# Altium project Common_Sensor_Box.PrjPCB (part 8 of 17)

## Sheet Sensor_Box_Hub_OrangePi.SchDoc: Title
size 420 x 297 mm; Author: G.Kasprowicz; CompanyName: WUT ISE; DrawnBy: G.Kasprowicz; Organization: WUT ISE; Address1: PW ISE; Address2: Nowowiejska 15/19 00-665 Warsaw; Address3: gkasprow@gmail.com; Revision: 1.0; SheetNumber: -; SheetTotal: -; ModifiedBy: -; CheckedDate: -; Title2: Title2; DivGrp: WUT ISE; Designer: G.Kasprowicz; ModifiedDate: -; ProjectName: Sensor Box
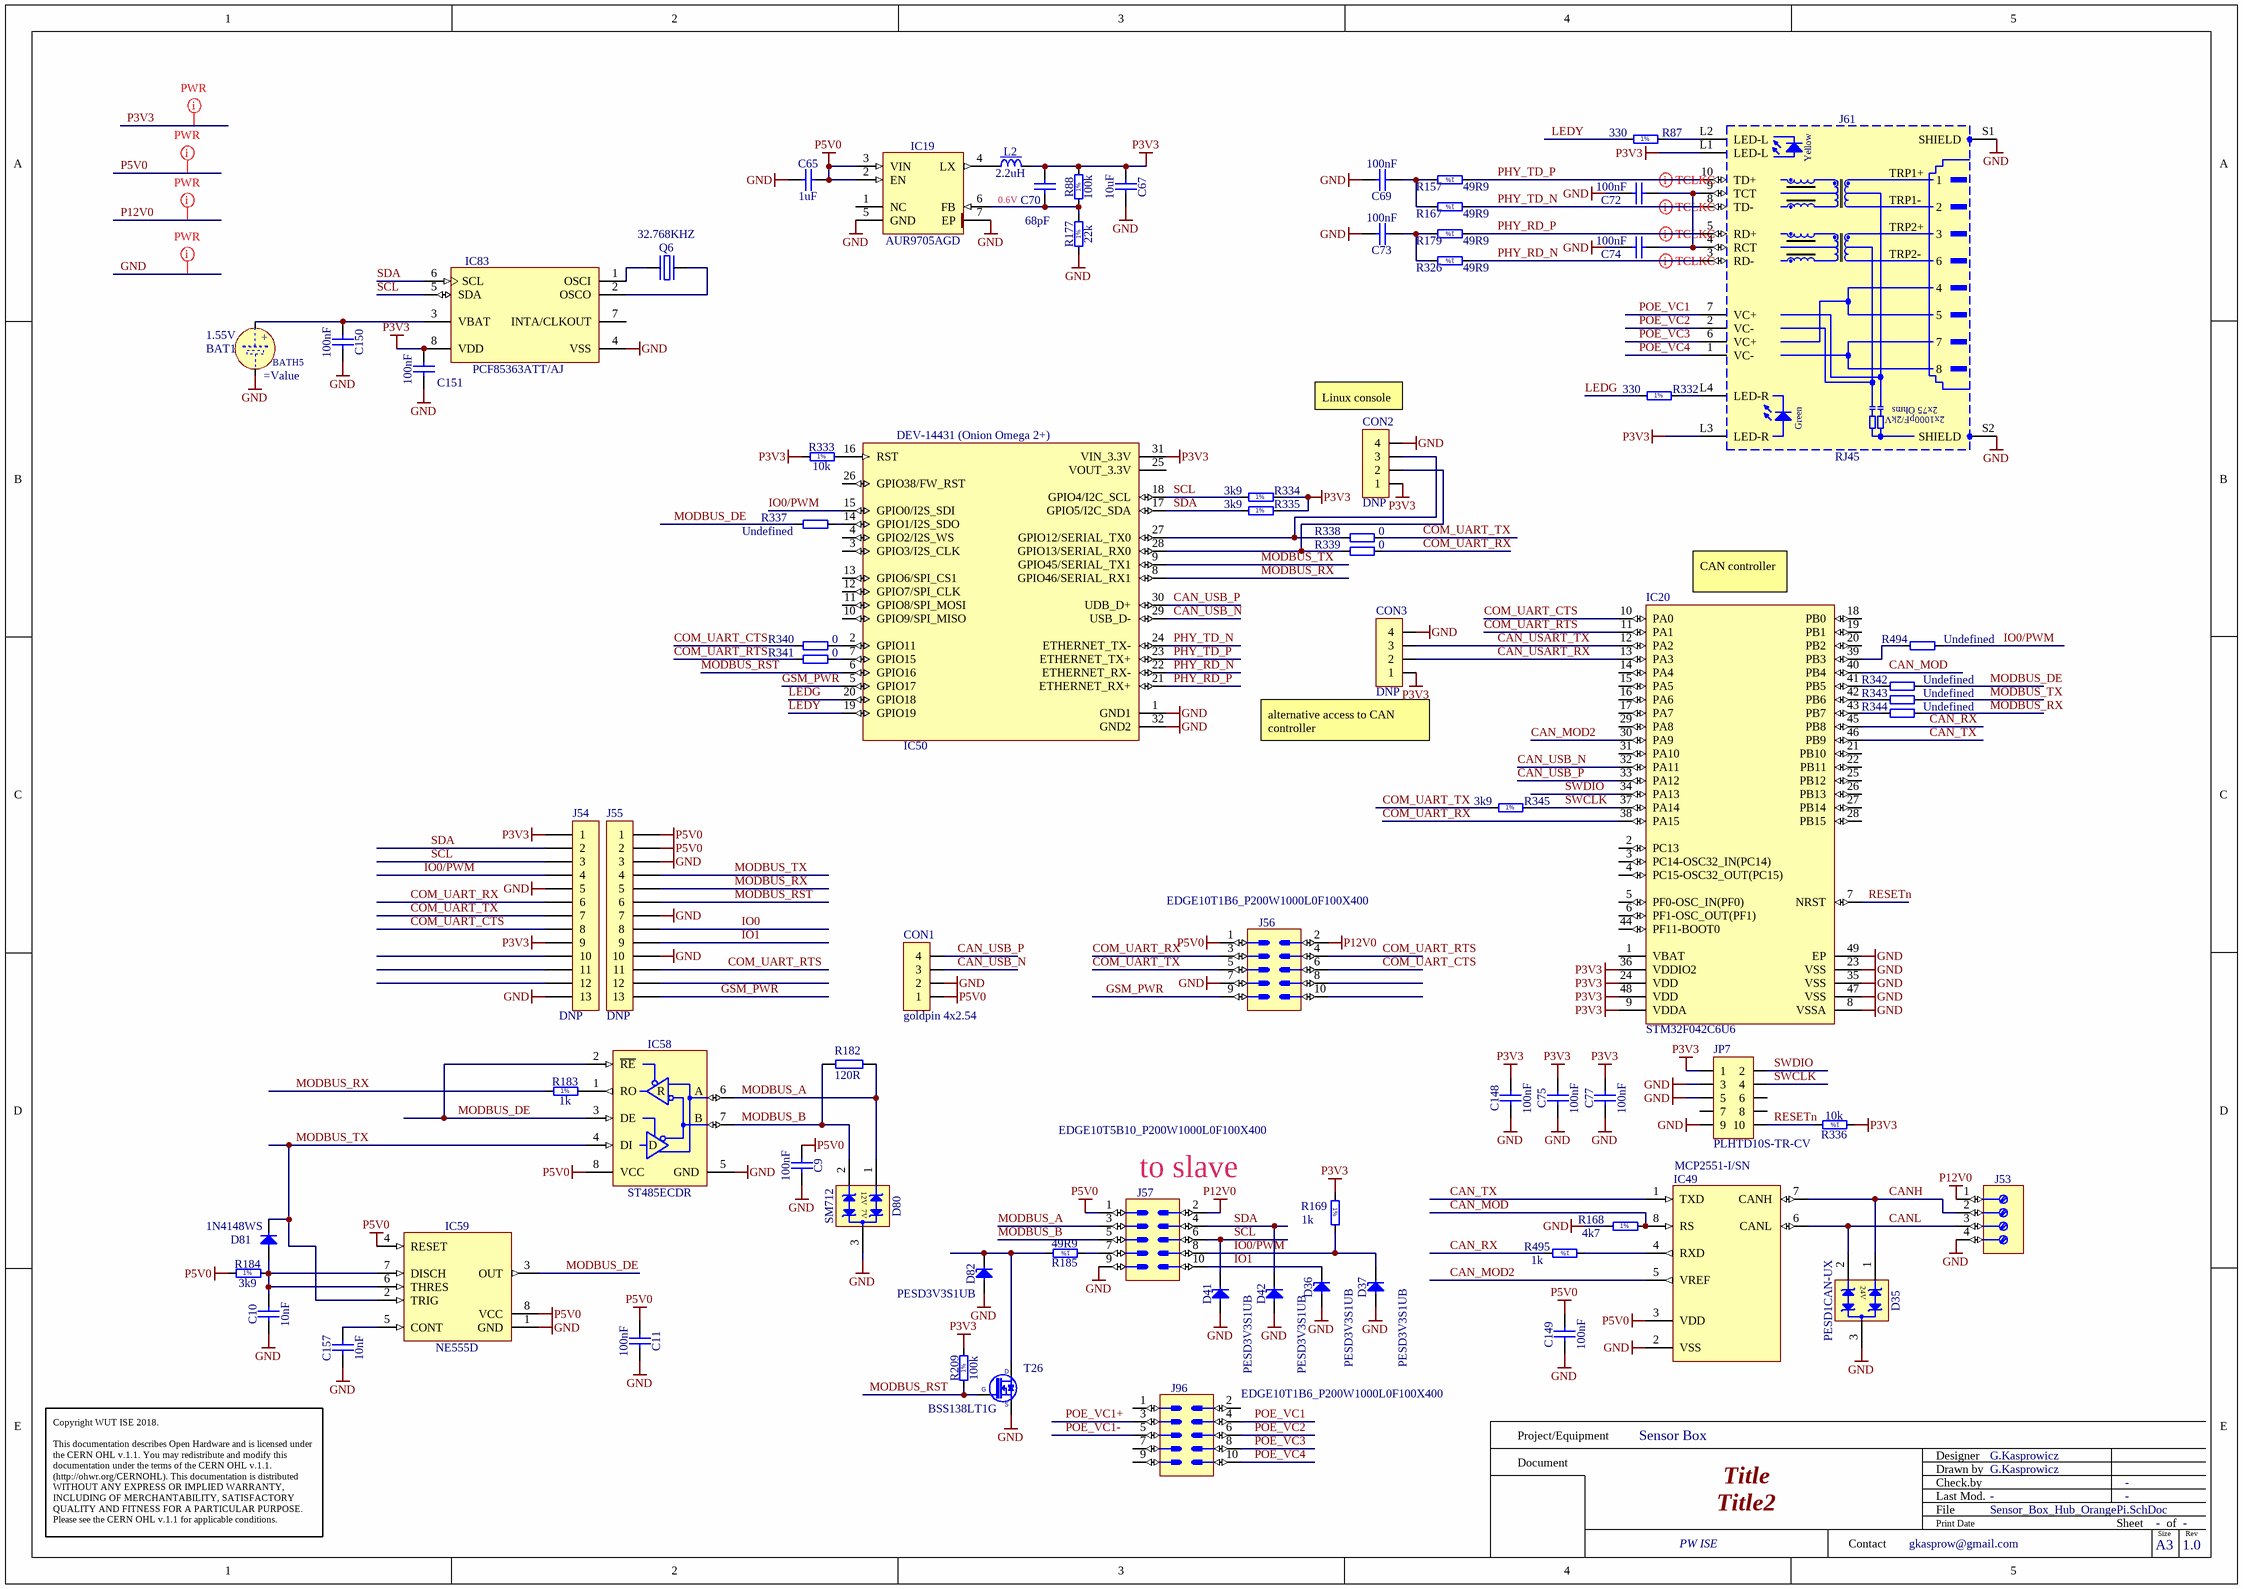
[diagram p13: Sensor_Box_Hub_OrangePi.SchDoc]

### Parts
(Parts that share a designator on the sheet are numbered #1, #2 ... from top to bottom, then left to right.)
BAT1  1.55V  [BAT_VARTA_V 364 MF]
BATH5  (no value)  [BATH_KEYSTONE_2998]
C9  100nF  [CAPC1005X55N]
C10  10nF  [CAPC1608X87N]
C11  100nF  [CAPC1005X55N]
C65#2  1uF  [CAPC1005X55N]
C67#2  10uF  [CAPC2012X135N]
C69#2  100nF  [CAPC1005X55N]
C70#2  68pF  [CAPC1608X87N]
C72#2  100nF  [CAPC1005X55N]
C73#2  100nF  [CAPC1005X55N]
C74#2  100nF  [CAPC1005X55N]
C75#2  100nF  [CAPC1005X55N]
C77#2  100nF  [CAPC1005X55N]
C148  100nF  [CAPC1005X55N]
C149  100nF  [CAPC1005X55N]
C150  100nF  [CAPC1005X55N]
C151  100nF  [CAPC1005X55N]
C157#2  10nF  [CAPC1608X87N]
CON1  goldpin 4x2.54  [SIP4]
CON2  DNP  [SIP4]
CON3  DNP  [SIP4]
D35  PESD1CAN-UX  [SOT95P237X112-3N]
D36  PESD3V3S1UB  [SODFL1608X65N]
D37  PESD3V3S1UB  [SODFL1608X65N]
D41  PESD3V3S1UB  [SODFL1608X65N]
D42  PESD3V3S1UB  [SODFL1608X65N]
D80  SM712  [SOT95P237X112-3N]
D81  1N4148WS  [SODFL2512X100N]
D82  PESD3V3S1UB  [SODFL1608X65N]
IC19#2  AUR9705AGD  [SON65P200X200X80-7N-R65X145]
IC20#2  STM32F042C6U6  [STM-UFQFPN48_L]
IC49  MCP2551-I/SN  [SOIC127P600X175-8N]
IC50  DEV-14431 (Onion Omega 2+)  [XCVR_OMEGA2]
IC58#1  ST485ECDR  [SOIC127P600X175-8N]
IC59  NE555D  [SOIC127P600X175-8N]
IC83  PCF85363ATT/AJ  [SOP50P310X90-8N]
J53  (no value)  [PHOENIX_1725672]
J54  DNP  [SIP13]
J55  DNP  [SIP13]
J56  (no value)  [EDGE10T1B6_P200W1000L0F100X400]
J57  (no value)  [EDGE10T5B10_P200W1000L0F100X400]
J61  RJ45  [ABRACON_ARJM11C7-114-BA-EW2]
J96  (no value)  [EDGE10T1B6_P200W1000L0F100X400]
JP7#2  PLHTD10S-TR-CV  [PLHTD10S-TR-CV]
L2  2.2uH  [IND_MURATA_LQH44PN_P0]
Q6  32.768KHZ  [XTAL_ABRACON_ABS09]
R87#2  330  [RESC1005X40N]
R88#2  100k  [RESC1005X40N]
R157  49R9  [RESC1005X40N]
R167  49R9  [RESC1005X40N]
R168  4k7  [RESC1005X40N]
R169  1k  [RESC1005X40N]
R177  22k  [RESC1005X40N]
R179  49R9  [RESC1005X40N]
R182  120R  [1206R]
R183  1k  [RESC1005X40N]
R184  3k9  [RESC1005X40N]
R185  49R9  [RESC1005X40N]
R209#1  100k  [RESC1005X40N]
R326  49R9  [RESC1005X40N]
R332  330  [RESC1005X40N]
R333  10k  [RESC1005X40N]
R334  3k9  [RESC1005X40N]
R335  3k9  [RESC1005X40N]
R336  10k  [RESC1005X40N]
R337  Undefined  [RESC1608X55N]
R338  0  [RESC1608X55N]
R339  0  [RESC1608X55N]
R340  0  [RESC1608X55N]
R341  0  [RESC1608X55N]
R342  Undefined  [RESC1608X55N]
R343  Undefined  [RESC1608X55N]
R344  Undefined  [RESC1608X55N]
R345  3k9  [RESC1005X40N]
R494  Undefined  [RESC1608X55N]
R495  1k  [RESC1005X40N]
T26  BSS138LT1G  [SOT95P240X110-3N]

### Nets
GND: BATH5.2(MINUS) C9.2 C10.1 C11.2 C65#2.1 C67#2.2 C69#2.2 C72#2.2 C73#2.2 C74#2.2 C75#2.1 C77#2.1 C148.1 C149.1 C150.2 C151.2 C157#2.1 CON1.2 CON2.4 CON3.4 D35.3(GND) D36.2(A) D37.2(A) D41.2(A) D42.2(A) D80.3(GND) D82.2(A) IC19#2.5(GND) IC19#2.7(EP) IC20#2.8(VSSA) IC20#2.23(VSS) IC20#2.35(VSS) IC20#2.47(VSS) IC20#2.49(EP) IC49.2(VSS) IC50.1(GND1) IC50.32(GND2) IC58#1.5(GND) IC59.1(GND) IC83.4(VSS) J53.4 J54.5 J54.13 J55.3 J55.7 J55.10 J56.7 J57.9 J61.S1(SHIELD) J61.S2(SHIELD) JP7#2.3 JP7#2.5 JP7#2.9 R168.1 R177.1 T26.2(S)
P3V3: C67#2.1 C70#2.2 C75#2.2 C77#2.2 C148.2 C151.1 CON2.1 CON3.1 IC20#2.9(VDDA) IC20#2.24(VDD) IC20#2.36(VDDIO2) IC20#2.48(VDD) IC50.31(VIN_3.3V) IC83.8(VDD) J54.1 J54.9 J61.L1(LED-L) J61.L3(LED-R) JP7#2.1 L2.2 R88#2.2 R169.1 R209#1.2 R333.1 R334.2 R335.2 R336.1
P5V0: C9.1 C11.1 C65#2.2 C149.2 CON1.1 IC19#2.2(EN) IC19#2.3(VIN) IC49.3(VDD) IC58#1.8(VCC) IC59.4(RESET) IC59.8(VCC) J55.1 J55.2 J56.1 J57.1 R184.1
P12V0: J53.1 J56.2 J57.2
CAN_MOD: IC20#2.40(PB4) IC49.8(RS) R168.2
CAN_MOD2: IC20#2.30(PA9) IC49.5(VREF)
CAN_RX: IC20#2.45(PB8) R495.2
CAN_TX: IC20#2.46(PB9) IC49.1(TXD)
CAN_USART_RX: CON3.2 IC20#2.13(PA3)
CAN_USART_TX: CON3.3 IC20#2.12(PA2)
CAN_USB_N: CON1.3 IC20#2.32(PA11) IC50.29(USB_D-)
CAN_USB_P: CON1.4 IC20#2.33(PA12) IC50.30(UDB_D+)
CANH: D35.1(I/O1) IC49.7(CANH) J53.2
CANL: D35.2(I/O2) IC49.6(CANL) J53.3
COM_UART_CTS: IC20#2.10(PA0) J54.8 J56.6 R340.1
COM_UART_RTS: IC20#2.11(PA1) J55.11 J56.4 R341.1
COM_UART_RX: IC20#2.38(PA15) J54.6 J56.3 R339.2
COM_UART_TX: J54.7 J56.5 R338.2 R345.1
GSM_PWR: IC50.5(GPIO17) J55.13 J56.9
IO0: J55.8
IO0/PWM: D37.1(C) IC50.15(GPIO0/I2S_SDI) J54.4 J57.8 R169.2 R494.2
IO1: D36.1(C) J55.9 J57.10
LEDG: IC50.20(GPIO18) R332.1
LEDY: IC50.19(GPIO19) R87#2.1
MODBUS_A: D80.1(I/O1) IC58#1.6(A) J57.3 R182.2
MODBUS_B: D80.2(I/O2) IC58#1.7(B) J57.5 R182.1
MODBUS_DE: IC58#1.2(~{RE}) IC58#1.3(DE) IC59.3(OUT) R337.1 R342.2
MODBUS_RST: IC50.6(GPIO16) J55.6 R209#1.1 T26.1(G)
MODBUS_RX: IC50.8(GPIO46/SERIAL_RX1) J55.5 R183.1 R344.2
MODBUS_TX: D81.1(C) IC50.9(GPIO45/SERIAL_TX1) IC58#1.4(DI) IC59.2(TRIG) J55.4 R343.2
PHY_RD_N: IC50.22(ETHERNET_RX-) J61.3(RD-) R326.1
PHY_RD_P: IC50.21(ETHERNET_RX+) J61.5(RD+) R179.1
PHY_TD_N: IC50.24(ETHERNET_TX-) J61.8(TD-) R167.1
PHY_TD_P: IC50.23(ETHERNET_TX+) J61.10(TD+) R157.1
POE_VC1: J61.7(VC+) J96.4
POE_VC1+: J96.3
POE_VC1-: J96.5
POE_VC2: J61.2(VC-) J96.6
POE_VC3: J61.6(VC+) J96.8
POE_VC4: J61.1(VC-) J96.10
RESETn: IC20#2.7(NRST) JP7#2.10 R336.2
SCL: D41.1(C) IC50.18(GPIO4/I2C_SCL) IC83.5(SDA) J54.3 J57.6 R334.1
SDA: D42.1(C) IC50.17(GPIO5/I2C_SDA) IC83.6(SCL) J54.2 J57.4 R335.1
SWCLK: IC20#2.37(PA14) JP7#2.4 R345.2
SWDIO: IC20#2.34(PA13) JP7#2.2
NetBATH5_1: BATH5.1(PLUS) C150.1 IC83.3(VBAT)
NetC10_2: C10.2 D81.2(A) IC59.6(THRES) IC59.7(DISCH) R184.2
NetC69#2_1: C69#2.1 R157.2 R167.2
NetC70#2_1: C70#2.1 IC19#2.6(FB) R88#2.1 R177.2
NetC72#2_1: C72#2.1 C74#2.1 J61.4(RCT) J61.9(TCT)
NetC73#2_1: C73#2.1 R179.2 R326.2
NetC157#2_2: C157#2.2 IC59.5(CONT)
NetCON2_2: CON2.2 IC50.28(GPIO13/SERIAL_RX0) R339.1
NetCON2_3: CON2.3 IC50.27(GPIO12/SERIAL_TX0) R338.1
NetD82_1: D82.1(C) R185.2 T26.3(D)
NetIC19#2_4: IC19#2.4(LX) L2.1
NetIC20#2_39: IC20#2.39(PB3) R494.1
NetIC20#2_41: IC20#2.41(PB5) R342.1
NetIC20#2_42: IC20#2.42(PB6) R343.1
NetIC20#2_43: IC20#2.43(PB7) R344.1
NetIC49_4: IC49.4(RXD) R495.1
NetIC50_2: IC50.2(GPIO11) R340.2
NetIC50_7: IC50.7(GPIO15) R341.2
NetIC50_14: IC50.14(GPIO1/I2S_SDO) R337.2
NetIC50_16: IC50.16(RST) R333.2
NetIC58#1_1: IC58#1.1(RO) R183.2
NetIC83_1: IC83.1(OSCI) Q6.1(OSC1)
NetIC83_2: IC83.2(OSCO) Q6.2(OSC2)
NetJ57_7: J57.7 R185.1
NetJ61_L2: J61.L2(LED-L) R87#2.2
NetJ61_L4: J61.L4(LED-R) R332.2

Not connected (* = marked no-connect by the designer): IC19#2 1(NC); IC20#2 1(VBAT) 2(PC13) 3(PC14-OSC32_IN(PC14)) 4(PC15-OSC32_OUT(PC15)) 5(PF0-OSC_IN(PF0)) 6(PF1-OSC_OUT(PF1)) 14(PA4) 15(PA5) 16(PA6) 17(PA7) 18(PB0) 19(PB1) 20(PB2) 21(PB10) 22(PB11) 25(PB12) 26(PB13) 27(PB14) 28(PB15) 29(PA8) 31(PA10) 44(PF11-BOOT0); IC50 3(GPIO3/I2S_CLK) 4(GPIO2/I2S_WS) 10(GPIO9/SPI_MISO) 11(GPIO8/SPI_MOSI) 12(GPIO7/SPI_CLK) 13(GPIO6/SPI_CS1) 25(VOUT_3.3V) 26(GPIO38/FW_RST); IC83 7(INTA/CLKOUT); J54 10 11 12; J55 12; J56 8 10; J96 1 2 7 9; JP7#2 6 7 8

### Layout directives
net class PWR: GND, P3V3, P5V0, P12V0
differential pair: PHY_RD_N, PHY_RD_P, PHY_TD_N, PHY_TD_P

### Notes on the sheet
- 0.6V
- (near CON2) Linux console
- (near IC20#2) CAN controller
- (near CON3) alternative access to CAN controller
- (near J57) to slave
- Project/Equipment
- Document
- Designer
- Drawn by
- Check.by
- Copyright WUT ISE 2018.
  This documentation describes Open Hardware and is licensed under the CERN OHL v.1.1. You may redistribute and modify this documentation under the terms of the CERN OHL v.1.1. (http://ohwr.org/CERNOHL). This documentation is distributed WITHOUT ANY EXPRESS OR IMPLIED WARRANTY, INCLUDING OF MERCHANTABILITY, SATISFACTORY QUALITY AND FITNESS FOR A PARTICULAR PURPOSE. Please see the CERN OHL v.1.1 for applicable conditions.
- Contact
- File
- Last Mod.
- Print Date
- Sheet
- Size
- A3
- of
- Rev
- (in symbol BAT_VARTA_V 364 MF) +
- (in symbol BATH_KEYSTONE_2998) +
- (in symbol CON_ETH_POE_ARJM11C7) Yellow; TRP1+; TRP1-; TRP2+; TRP2-; 2x75 Ohms; Green; 2x1000pF/2kV
- (in symbol R0402_1K_1%_0.0625W_100PPM) 1%
- (in symbol R0402_3K9_1%_0.0625W_100PPM) 1%
- (in symbol R0402_4K7_1%_0.0625W_100PPM) 1%
- (in symbol R0402_10K_1%_0.0625W_100PPM) 1%
- (in symbol R0402_22K_1%_0.0625W_100PPM) 1%
- (in symbol R0402_49R9_1%_0.0625W_100PPM) 1%
- (in symbol R0402_100K_1%_0.0625W_100PPM) 1%
- (in symbol R0402_330R_1%_0.0625W_100PPM) 1%
- (in symbol SM712) 12V; 7V
- (in symbol ST485ECDR) R; D

### Library data of the parts
BAT1 = BAT_VARTA_V 364 MF: Battery for use only with Socket Holder; Part Description: CR60, 6.8mm Diameter x 2.2mm  Height Silver Oxide Buttun Cell Battery; Manufacturer: VARTA; Manufacturer Part Number: V 364 MF; PressFit: No; Power: 17mAh; Part Number: BAT_VARTA_V 364 MF; Component Kind: Standard; Component Type: Standard; Pin Count: 0; PackageDescription: CR60, 6.8mm Diameter x 2.2mm  Height Silver Oxide Buttun Cell Battery; Family: Battery; Mounted: Yes; Socket: Yes; SMD: No; Sense: No; Value: 1.55V; ComponentHeight: 2.15mm; HelpURL: \\cern.ch\dfs\Applications\Altium\Datasheets\BAT_VARTA_V 364 MF.pdf; Author: CERN DEM JLC; CreateDate: 03.07.2014; LatestRevisionDate: 03.07.2014
BATH5 = BATH_KEYSTONE_2998: Battery Holder whit 2 Pin; Part Description: SMD Battery Holder for MC621, V364, SC621, DR13H, DR77, V13AT, 377 Button Cells; Manufacturer Part Number: 2998; PressFit: No; Part Number: BATH_KEYSTONE_2998; Component Kind: Standard; Component Type: Standard; Pin Count: 3; PackageDescription: SMD Battery Holder for MC621, V364, SC621, DR13H, DR77, V13AT, 377 Button Cells; Family: Battery; Mounted: Yes; Socket: No; SMD: Yes; Sense: No; Manufacturer: KEYSTONE; ComponentHeight: 3.048mm; HelpURL: \\cern.ch\dfs\Applications\Altium\Datasheets\BATH_KEYSTONE_2998.pdf; Author: CERN DEM JLC; CreateDate: 03.07.2014; LatestRevisionDate: 07.06.2017
C9 C11 C150 C151 = CC0402_100NF_16V_10%_X7R: as C178-C180 on sheet Sensor_Box_Smart_IO; Part Number: CC0402_100NF_16V_10%_X7R; Component Kind: Standard; Component Type: Standard; Pin Count: 2; Value: 100nF; Status: Not Recommended; Manufacturer Part Number: CC0402_100NF_16V_10%_X7R; Case: 0402; Mounted: Yes; Socket: No; SMD: Yes; Manufacturer1 Example: MURATA; Manufacturer1 ComponentHeight: 0.55mm; HelpURL: \\cern.ch\dfs\Applications\Altium\Datasheets\CC0402_X7R_MURATA_GRM.pdf; Author: CERN DEM JLC; CreateDate: 05.12.2013; LatestRevisionDate: 03.12.2007; Sense: No
C10 C157#2 = CC0603_10NF_50V_5%_C0G: Non-polarised capacitor; Part Description: SMD Multilayer Chip Ceramic Capacitor; Manufacturer: GENERIC; Manufacturer1 Part Number: C1608C0G1H103J080AA; Voltage: 50V; TC: C0G/NP0; Tolerance: ±5%; Part Number: CC0603_10NF_50V_5%_C0G; Component Kind: Standard; Component Type: Standard; Pin Count: 2; Value: 10nF; Status: Preferred; Manufacturer Part Number: CC0603_10NF_50V_5%_C0G; Case: 0603; Mounted: Yes; Socket: No; SMD: Yes; Sense: No; Manufacturer1 Example: TDK; Manufacturer1 ComponentHeight: 0.9mm; HelpURL: \\cern.ch\dfs\Applications\Altium\Datasheets\CC0603_C0G_TDK_C.pdf; Author: CERN DEM JLC; CreateDate: 10.12.2014; LatestRevisionDate: 10.12.2014
C65#2 = CC0402_1UF_16V_10%_X5R: as C181-C183 on sheet Sensor_Box_Smart_IO; Part Number: CC0402_1UF_16V_10%_X5R; Component Kind: Standard; Component Type: Standard; Pin Count: 2; Value: 1uF; Status: Preferred; Manufacturer Part Number: CC0402_1UF_16V_10%_X5R; Case: 0402; Mounted: Yes; Socket: No; SMD: Yes; Sense: No; Manufacturer1 Example: TDK; Manufacturer1 ComponentHeight: 0.55mm; HelpURL: \\cern.ch\dfs\Applications\Altium\Datasheets\CC0402_X5R_TDK_C.pdf; Author: CERN DEM JLC; CreateDate: 25.10.2012; LatestRevisionDate: 25.10.2012
C67#2 = CC0805_10UF_16V_10%_X5R: as C184 on sheet Sensor_Box_Smart_IO; Part Number: CC0805_10UF_16V_10%_X5R; Component Kind: Standard; Component Type: Standard; Pin Count: 2; Value: 10uF; Status: Preferred; Manufacturer Part Number: CC0805_10UF_16V_10%_X5R; Case: 0805; Mounted: Yes; Socket: No; SMD: Yes; Manufacturer1 Example: KEMET; Manufacturer1 ComponentHeight: 1.4mm; HelpURL: \\cern.ch\dfs\Applications\Altium\Datasheets\CC1206_X5R_KEMET.pdf; Author: CERN DEM JLC; CreateDate: 03.12.2007; LatestRevisionDate: 03.12.2007; Sense: No
C69#2 C72#2 C73#2 C74#2 C75#2 C77#2 C148 C149 = CC0402_100NF_16V_10%_X5R: as C188#1 on sheet Sensor_Box_Smart_IO; Part Number: CC0402_100NF_16V_10%_X5R; Component Kind: Standard; Component Type: Standard; Pin Count: 2; Value: 100nF; Status: None; Manufacturer Part Number: CC0402_100NF_16V_10%_X5R; Case: 0402; Mounted: Yes; Socket: No; SMD: Yes; Manufacturer1 Example: MURATA; Manufacturer1 ComponentHeight: 0.55mm; HelpURL: \\cern.ch\dfs\Applications\Altium\Datasheets\CC0402_X5R_MURATA_GRM.pdf; Author: CERN DEM JLC; CreateDate: 10.12.2013; LatestRevisionDate: 10.12.2013; Sense: No
C70#2 = CC0603_68PF_50V_5%_NP0: Non-polarised capacitor; Part Description: SMD Multilayer Chip Ceramic Capacitor; Manufacturer: GENERIC; Manufacturer1 Part Number: 223886715689; Voltage: 50V; TC: C0G/NP0; Tolerance: ±5%; Part Number: CC0603_68PF_50V_5%_NP0; Component Kind: Standard; Component Type: Standard; Pin Count: 2; Value: 68pF; Status: Preferred; Manufacturer Part Number: CC0603_68PF_50V_5%_NP0; Case: 0603; Mounted: Yes; Socket: No; SMD: Yes; Sense: No; Manufacturer1 Example: PHYCOMP; Manufacturer1 ComponentHeight: 0.87mm; HelpURL: \\cern.ch\dfs\Applications\Altium\Datasheets\CC0603_NP0_PHYCOMP.pdf; Author: CERN DEM JLC; CreateDate: 03.12.2007; LatestRevisionDate: 03.12.2007
CON1-CON3 = CON4x2.54: Connector; Supplier 1: Newark; Supplier Part Number 1: 67R8277
D35 = D_TVS_PESD1CAN: TVS Diode for CAN; Manufacturer: Nexperia; Voltage: 24V; Power: 400W; PressFit: No; Bonding: No; Part Number: PESD1CAN-UX; Component Kind: Standard; Component Type: Standard; Device: PESD1CAN-UX; PackageDescription: SOT, 0.95mm, pitch; 3 pin,1.30mm W X 2.92mm L X 1.12mm H body, IPC Medium Density; Part Description: TVS Diode for CAN; Manufacturer Part Number: PESD1CAN-UX; Pin Count: 3; Case: SOT-23; Mounted: Yes; Socket: No; SMD: Yes; Sense: No; ComponentHeight: 1.12mm; HelpURL: \\cern.ch\dfs\Applications\Altium\Datasheets\SM712.TCT.pdf; Author: CERN DEM JLC; CreateDate: 03.09.2014; LatestRevisionDate: 13.01.2015
D36 D37 D41 D42 D82 = PESD3V3S1UB: as D55 on sheet Sensor_Box_Smart_IO; Part Number: PESD3V3S1UB; Component Kind: Standard; Component Type: Standard; Device: PESD3V3S1UB; PackageDescription: Ultra Small Outline Diode Flat Lead (SOD-523), Body; 1.2mm L X 0.8mm W X 0.65mm H, IPC Medium Density; Manufacturer Part Number: PESD3V3S1UB; Pin Count: 2; Case: SOD523; Mounted: Yes; Socket: No; SMD: Yes; Sense: No; ComponentHeight: 0.65mm; HelpURL: \\cern.ch\dfs\Applications\Altium\Datasheets\PESD3V3S1UB.pdf; Author: CERN DEM JLC; CreateDate: 29.11.2012; LatestRevisionDate: 29.11.2012
D80 = SM712: as D90 on sheet Sensor_Box_Smart_IO; Part Number: SM712; Component Kind: Standard; Component Type: Standard; Device: SM712; PackageDescription: SOT, 0.95mm, pitch; 3 pin,1.30mm W X 2.92mm L X 1.12mm H body, IPC Medium Density; Status: Obsolete; Part Description: Asymmetrical TVS Diode for Extended Common-Mode RS-485; Manufacturer Part Number: SM712; Pin Count: 3; Case: SOT-23; Mounted: Yes; Socket: No; SMD: Yes; Sense: No; ComponentHeight: 1.12mm; HelpURL: \\cern.ch\dfs\Applications\Altium\Datasheets\SM712.pdf; Author: CERN DEM JLC; CreateDate: 23.04.2012; LatestRevisionDate: 23.04.2012
D81 = 1N4148WS: as D56-D61 on sheet Sensor_Box_Smart_IO; Part Number: 1N4148WS; Component Kind: Standard; Component Type: Standard; Device: 1N4148WS; PackageDescription: SODFL Diode; 1.70mm W X 1.25mm L X 1.00mm H body, IPC Medium Density; Manufacturer Part Number: 1N4148WS; Pin Count: 2; Case: SOD-323F; Mounted: Yes; Socket: No; SMD: Yes; Sense: No; ComponentHeight: 1mm; HelpURL: \\cern.ch\dfs\Applications\Altium\Datasheets\1N4148WS.pdf; Author: CERN DEM JLC; CreateDate: 12.05.2011; LatestRevisionDate: 12.05.2011
IC19#2 = AUR9705AGD: 0V to 6V Input, 1A, 1.5MHz, Step-Down DC-DC Converter; Manufacturer: DIODES INCORPORATED; PressFit: No; Bonding: No; Part Number: AUR9705AGD; Component Kind: Standard; Component Type: Standard; Device: AUR9705AGD; PackageDescription: SON, 0.65mm Pitch, 6 Pin, 2.00mm W X 2.00mm L X 0.80mm H body (W/Thermal Tab 0.65mm X 1.45mm), IPC Medium Density; Part Description: 0V to 6V Input, 1A, 1.5MHz, Step-Down DC-DC Converter; Manufacturer Part Number: AUR9705AGD; Pin Count: 7; Case: SON6; Mounted: Yes; Socket: No; SMD: Yes; Sense: No; ComponentHeight: 0.8mm; HelpURL: \\cern.ch\dfs\Applications\Altium\Datasheets\AUR9705AGD.pdf; Author: CERN DEM MR; CreateDate: 15.02.2018; LatestRevisionDate: 15.02.2018
IC20#2 = CMP-0304-00104-1: ARM Cortex-M0 32-bit MCU, 32 KB Flash, 6 KB Internal RAM, 38 I/Os, 48-Pin UFQFPN, -40 to 85 degC, Tray; Internal RAM Size (kB): 6; Supply Voltage(Vcc) min (V): 2; I/Os (High Current): 38; FLASH Size (Prog) (kB): 32; Operating Frequency(F) (Processor speed) (MHz): 48; ComponentLink2Description: Datasheet; Mounting Technology: Surface Mount; ComponentLink1Description: Manufacturer URL; ComponentLink1URL: http://www.st.com/; Core: ARM Cortex-M0; Package Reference: UFQFPN48; Packing: Tray; ComponentLink2URL: http://www.st.com/st-web-ui/static/active/en/resource/technical/document/datasheet/DM00105814.pdf; DatasheetVersion: Rev. 5; Package Description: 48-Pin Ultra Thin Fine Pitch Quad Flat No-Lead, 7 x 7 x 0.6 mm Body, 0.5 mm Pitch, Exposed Pad
IC49 = IFC_MCP2551: High-Speed CAN Transceiver, 8-Pin SOIC, Industrial Temperature; Manufacturer: MICROCHIP TECHNOLOGY; PressFit: No; Bonding: No; Part Number: MCP2551-I/SN; Component Kind: Standard; Component Type: Standard; Device: MCP2551-I/SN; PackageDescription: SOIC 8, Pitch 1.27mm - Body 4x5mm, IPC Medium Density; Part Description: High-Speed CAN Transceiver; Manufacturer Part Number: MCP2551-I/SN; Pin Count: 8; Case: SOIC8; Mounted: Yes; Socket: No; SMD: Yes; Sense: No; ComponentHeight: 1.75mm; Author: GK; CreateDate: 07.09.2016; LatestRevisionDate: 07.09.2016
IC50 = MOD_OMEGA2: Onion OMEGA2+ Iot Computer; MP: OMEGA2; Package: None; SnapEDA_Link: https://www.snapeda.com/parts/OMEGA2/Onion/view-part/?ref=snap; Availability: Unavailable; MF: Onion; Price: None; Value: *
IC58#1 = ST485ECDR: as IC82 on sheet Sensor_Box_Smart_IO; Part Number: ST485ECDR; Component Kind: Standard; Component Type: Standard; Device: ST485ECDR; PackageDescription: SOIC 8, Pitch 1.27mm - Body 4x5mm, IPC Medium Density; Part Description: ±15kV ESD-Protected, Low Power  RS-485/RS-422 Transceiver; Manufacturer Part Number: ST485ECDR; Pin Count: 8; Case: SOIC8; Mounted: Yes; Socket: No; SMD: Yes; Sense: No; ComponentHeight: 1.75mm; Author: CERN DEM MR; HelpURL: \\cern.ch\dfs\Applications\Altium\Datasheets\ST485ECDR.pdf; CreateDate: 15.02.2018; LatestRevisionDate: 15.02.2018
IC59 = NE555D: Precision Timer; Manufacturer: TEXAS INSTRUMENTS; PressFit: No; Bonding: No; Part Number: NE555D; Component Kind: Standard; Component Type: Standard; Device: NE555D; PackageDescription: SOIC 8, Pitch 1.27mm, Body 4x5mm, IPC Medium Density; Part Description: Precision Timer; Manufacturer Part Number: NE555D; Pin Count: 8; Case: SOIC8; Mounted: Yes; Socket: No; SMD: Yes; Sense: No; ComponentHeight: 1.75mm; Author: CERN DEM JMW; HelpURL: \\cern.ch\dfs\Applications\Altium\Datasheets\NE555D.pdf; CreateDate: 16.04.2009; LatestRevisionDate: 16.04.2009
IC83 = RTC_PCF85363ATT: Tiny Real-Time Clock/calendar with 64 byte RAM, alarm  function, battery switch-over  time stamp input, and I 2 C-bus; Manufacturer: NXP; PressFit: No; Bonding: No; Part Number: PCF85363ATT/AJ; Component Kind: Standard; Component Type: Standard; Device: PCF85363ATT/AJ; PackageDescription: SOP, 0.50mm Pitch; 8 pin, 2.30mm W X 2.00mm L X 0.90mm H body, PC Medium Density; Part Description: Tiny Real-Time Clock/calendar with 64 byte RAM, alarm  function, battery switch-over  time stamp input, and I 2 C-bus; Manufacturer Part Number: PCF85363ATT/AJ; Pin Count: 8; Case: TSSOP8; Mounted: Yes; Socket: No; SMD: Yes; Sense: No; ComponentHeight: 1.3mm; Author: GK; HelpURL: \\cern.ch\dfs\Applications\Altium\Datasheets\PCA9306DCUR.pdf; CreateDate: 25.02.2013; LatestRevisionDate: 11.02.2016
J53 = PHOENIX_1725672: as J75-J77 on sheet Sensor_Box_Smart_IO; Part Number: PHOENIX_1725672; Component Kind: Standard; Component Type: Standard; Pin Count: 4; Mounted: Yes; Socket: No; SMD: No; Sense: No; Status: None; ComponentHeight: 8.5mm; HelpURL: \\cern.ch\dfs\Applications\Altium\Datasheets\PHOENIX_1725672.pdf; Author: CERN DEM JMW; CreateDate: 07.11.2008; LatestRevisionDate: 26.04.2010
J54 J55 = CON13
J56 J96 = EDGE10T1B6_P200W1000L0F100X400: as J82 on sheet Sensor_Box_Smart_IO; Part Number: EDGE10T1B6_P200W1000L0F100X400; Component Kind: Standard (No BOM); Component Type: Standard (No BOM); Pin Count: 10; Socket: No; SMD: No; Sense: No; Status: None; ComponentHeight: 0mm; HelpURL: \\cern.ch\dfs\Applications\Altium\Datasheets\EDGE10T1B6_P200W1000L0F100X400.pdf; Author: CERN DEM MR; CreateDate: 14.02.2018; LatestRevisionDate: 14.02.2018
J57 = EDGE10T5B10_P200W1000L0F100X400: as J80 on sheet Sensor_Box_Smart_IO; Part Number: EDGE10T5B10_P200W1000L0F100X400; Component Kind: Standard (No BOM); Component Type: Standard (No BOM); Pin Count: 10; Socket: No; SMD: No; Sense: No; Status: None; ComponentHeight: 0mm; HelpURL: \\cern.ch\dfs\Applications\Altium\Datasheets\EDGE10T5B10_P200W1000L0F100X400.pdf; Author: CERN DEM MR; CreateDate: 14.02.2018; LatestRevisionDate: 14.02.2018
J61 = CON_ETH_POE_ARJM11C7: MagJack 10/100BaseT, PoE+, 1X1, OG/Y, -40 to 85*C, Tab Up, RoHS; Part Number: ARJM11C7-114-BA-EW2; Part Description: 1 Port, Orange Green/Yellow LEDs, RJ45 10/100BaseT, PoE, Ethernet MagJack® Connector Module; Manufacturer: Abracon; PressFit: No; Component Kind: Standard; Component Type: Standard; Pin Count: 18; Family: RJ45; Mounted: Yes; Socket: No; SMD: No; Sense: No; Status: None; Manufacturer Part Number: ARJM11C7-114-BA-EW2; ComponentHeight: 13.61mm; HelpURL: \\cern.ch\dfs\Applications\Altium\Datasheets\BELFUSE_0826-1X1T-GJ-F.pdf; Author: GK; CreateDate: 05.11.2012; LatestRevisionDate: 05.11.2012
JP7#2 = CON_2x5 1.27 SMT Male: 1.27 mm dual row goldpin (Maritex)
L2 = IND_2.2UH_20%_MURATA_LQH44PN2R2MP0L: Inductor With Core; Part Description: Wire Wound Ferrite Inductor for Power Lines; Manufacturer: MURATA; Power: 1.8A; Resistance: 0R049; Tolerance: ±20%; Part Number: IND_2.2UH_20%_MURATA_LQH44PN2R2MP0L; Component Kind: Standard; Component Type: Standard; Pin Count: 2; Value: 2.2uH; Status: None; Manufacturer Part Number: LQH44PN2R2MP0L; Case: 4040; Mounted: Yes; Socket: No; SMD: Yes; Sense: No; ComponentHeight: 1.8mm; HelpURL: \\cern.ch\dfs\Applications\Altium\Datasheets\IND_MURATA_LQH44PN_P0.pdf; Author: CERN DEM JLC; CreateDate: 14.02.2018; LatestRevisionDate: 14.02.2018
Q6 = XTAL_32.768KHZ_ABRACON_ABS09-32.768KHZ-T: Quartz Crystal; Part Description: Tolerance: ±20ppm, Stability: ±5ppm, -40°C to +85°C, 12.5pF, SMD Low Profile Crystal, ABS09 Series; PressFit: No; Bonding: No; Part Number: XTAL_32.768KHZ_ABRACON_ABS09-32.768KHZ-T; Component Kind: Standard; Component Type: Standard; PackageDescription: 2 Pins, 4.1x1.5mm, SMD Low Profile Crystal, ABS09 Serie; Value: 32.768KHZ; Manufacturer: ABRACON; Manufacturer Part Number: ABS09-32.768KHZ-T; Pin Count: 2; Mounted: Yes; Socket: No; SMD: Yes; Sense: No; ComponentHeight: 0.9mm; HelpURL: \\cern.ch\dfs\Applications\Altium\Datasheets\XTAL_ABRACON_ABS09.pdf; Author: CERN DEM JLC; CreateDate: 16.10.2014; LatestRevisionDate: 16.10.2014
R87#2 R332 = R0402_330R_1%_0.0625W_100PPM: Resistor - 1%; Part Description: General Purpose Thick Film Chip Resistor; Manufacturer: GENERIC; Manufacturer1 Part Number: 232270673301L; TC: ±100ppm/°C; PressFit: No; Part Number: R0402_330R_1%_0.0625W_100PPM; Component Kind: Standard; Component Type: Standard; Pin Count: 2; Value: 330; Status: Not Recommended; Power: 0.0625W; Tolerance: ±1%; Manufacturer Part Number: R0402_330R_1%_0.0625W_100PPM; Case: 0402; Mounted: Yes; Sense: No; Socket: No; SMD: Yes; Manufacturer1 Example: YAGEO PHYCOMP; Manufacturer1 ComponentHeight: 0.4mm; HelpURL: \\cern.ch\dfs\Applications\Altium\Datasheets\R0402_Phycomp_RC0402.pdf; Author: CERN DEM JLC; CreateDate: 03.12.2007; LatestRevisionDate: 17.10.2012
R88#2 R209#1 = R0402_100K_1%_0.0625W_100PPM: as R257#2 on sheet Sensor_Box_Smart_IO; Part Number: R0402_100K_1%_0.0625W_100PPM; Component Kind: Standard; Component Type: Standard; Pin Count: 2; Value: 100k; Status: Not Recommended; Power: 0.0625W; Tolerance: ±1%; Manufacturer Part Number: R0402_100K_1%_0.0625W_100PPM; Case: 0402; Mounted: Yes; Sense: No; Socket: No; SMD: Yes; Manufacturer1 Example: YAGEO PHYCOMP; Manufacturer1 ComponentHeight: 0.4mm; HelpURL: \\cern.ch\dfs\Applications\Altium\Datasheets\R0402_Phycomp_RC0402.pdf; Author: CERN DEM JLC; CreateDate: 03.12.2007; LatestRevisionDate: 17.10.2012
R157 R167 R179 R185 R326 = R0402_49R9_1%_0.0625W_100PPM: as R232 on sheet Sensor_Box_Smart_IO; Part Number: R0402_49R9_1%_0.0625W_100PPM; Component Kind: Standard; Component Type: Standard; Pin Count: 2; Value: 49R9; Status: Not recommended; Power: 0.0625W; Tolerance: ±1%; Manufacturer Part Number: R0402_49R9_1%_0.0625W_100PPM; Case: 0402; Mounted: Yes; Socket: No; SMD: Yes; Manufacturer1 Example: YAGEO PHYCOMP; Manufacturer1 ComponentHeight: 0.4mm; HelpURL: \\cern.ch\dfs\Applications\Altium\Datasheets\R0402_Phycomp_RC0402.pdf; Author: CERN DEM JLC; CreateDate: 2012-10-24; LatestRevisionDate: 2012-10-24
R168 = R0402_4K7_1%_0.0625W_100PPM: Resistor - 1%; Part Description: General Purpose Thick Film Chip Resistor; Manufacturer: GENERIC; Manufacturer1 Part Number: 232270674702L; TC: ±100ppm/°C; PressFit: No; Part Number: R0402_4K7_1%_0.0625W_100PPM; Component Kind: Standard; Component Type: Standard; Pin Count: 2; Value: 4k7; Status: Not Recommended; Power: 0.0625W; Tolerance: ±1%; Manufacturer Part Number: R0402_4K7_1%_0.0625W_100PPM; Case: 0402; Mounted: Yes; Sense: No; Socket: No; SMD: Yes; Manufacturer1 Example: YAGEO PHYCOMP; Manufacturer1 ComponentHeight: 0.4mm; HelpURL: \\cern.ch\dfs\Applications\Altium\Datasheets\R0402_Phycomp_RC0402.pdf; Author: CERN DEM JLC; CreateDate: 03.12.2007; LatestRevisionDate: 17.10.2012
R169 R183 R495 = R0402_1K_1%_0.0625W_100PPM: as R233 on sheet Sensor_Box_Smart_IO; Part Number: R0402_1K_1%_0.0625W_100PPM; Component Kind: Standard; Component Type: Standard; Pin Count: 2; Value: 1k; Status: Not Recommended; Power: 0.0625W; Tolerance: ±1%; Manufacturer Part Number: R0402_1K_1%_0.0625W_100PPM; Case: 0402; Mounted: Yes; Sense: No; Socket: No; SMD: Yes; Manufacturer1 Example: YAGEO PHYCOMP; Manufacturer1 ComponentHeight: 0.4mm; HelpURL: \\cern.ch\dfs\Applications\Altium\Datasheets\R0402_Phycomp_RC0402.pdf; Author: CERN DEM JLC; CreateDate: 03.12.2007; LatestRevisionDate: 17.10.2012
R177 = R0402_22K_1%_0.0625W_100PPM: Resistor - 1%; Part Description: General Purpose Thick Film Chip Resistor; Manufacturer: GENERIC; Manufacturer1 Part Number: 232270672203L; TC: ±100ppm/°C; PressFit: No; Part Number: R0402_22K_1%_0.0625W_100PPM; Component Kind: Standard; Component Type: Standard; Pin Count: 2; Value: 22k; Status: Not Recommended; Power: 0.0625W; Tolerance: ±1%; Manufacturer Part Number: R0402_22K_1%_0.0625W_100PPM; Case: 0402; Mounted: Yes; Sense: No; Socket: No; SMD: Yes; Manufacturer1 Example: YAGEO PHYCOMP; Manufacturer1 ComponentHeight: 0.4mm; HelpURL: \\cern.ch\dfs\Applications\Altium\Datasheets\R0402_Phycomp_RC0402.pdf; Author: CERN DEM JLC; CreateDate: 03.12.2007; LatestRevisionDate: 17.10.2012
R182 = RES_1206: SMD Resistor; Supplier 1: Newark; Supplier Part Number 1: 39K0871
R184 R334 R335 R345 = R0402_3K9_1%_0.0625W_100PPM: Resistor - 1%; Part Description: General Purpose Thick Film Chip Resistor; Manufacturer: GENERIC; Manufacturer1 Part Number: 232270673902L; TC: ±100ppm/°C; PressFit: No; Part Number: R0402_3K9_1%_0.0625W_100PPM; Component Kind: Standard; Component Type: Standard; Pin Count: 2; Value: 3k9; Status: Not Recommended; Power: 0.0625W; Tolerance: ±1%; Manufacturer Part Number: R0402_3K9_1%_0.0625W_100PPM; Case: 0402; Mounted: Yes; Sense: No; Socket: No; SMD: Yes; Manufacturer1 Example: YAGEO PHYCOMP; Manufacturer1 ComponentHeight: 0.4mm; HelpURL: \\cern.ch\dfs\Applications\Altium\Datasheets\R0402_Phycomp_RC0402.pdf; Author: CERN DEM JLC; CreateDate: 03.12.2007; LatestRevisionDate: 17.10.2012
R333 R336 = R0402_10K_1%_0.0625W_100PPM: as R322#1 on sheet Sensor_Box_Smart_IO; Part Number: R0402_10K_1%_0.0625W_100PPM; Component Kind: Standard; Component Type: Standard; Pin Count: 2; Value: 10k; Status: Not Recommended; Power: 0.0625W; Tolerance: ±1%; Manufacturer Part Number: R0402_10K_1%_0.0625W_100PPM; Case: 0402; Mounted: Yes; Sense: No; Socket: No; SMD: Yes; Manufacturer1 Example: YAGEO PHYCOMP; Manufacturer1 ComponentHeight: 0.4mm; HelpURL: \\cern.ch\dfs\Applications\Altium\Datasheets\R0402_Phycomp_RC0402.pdf; Author: CERN DEM JLC; CreateDate: 03.12.2007; LatestRevisionDate: 17.10.2012
R337 R342-R344 R494 = R0603_NO-VALUE: Resistor; Part Description: Reserved Footprint For a 0603 (1608) Chip Resistor; PressFit: No; Mounted: No; Part Number: R0603_NO-VALUE; Component Kind: Standard; Component Type: Standard; Pin Count: 2; Value: Undefined; Status: None; Manufacturer: Undefined; Manufacturer Part Number: R0603_NO-VALUE; Case: 0603; Sense: No; Socket: No; SMD: Yes; Manufacturer1 Example: Undefined; Manufacturer1 Part Number: Undefined; Manufacturer1 ComponentHeight: Undefined; HelpURL: Undefined; Author: CERN DEM JLC; CreateDate: 03.12.2007; LatestRevisionDate: 13.03.2008
R338-R341 = R0603_0R_JUMPER: Resistor; Part Description: 1A (0.05R Max DC Resistance) Zero Ohm Jumper; Manufacturer: GENERIC; Manufacturer1 Part Number: NRC06Z0; PressFit: No; Part Number: R0603_0R_JUMPER; Component Kind: Standard; Component Type: Standard; Pin Count: 2; Value: 0; Status: Preferred; Manufacturer Part Number: R0603_0R_JUMPER; Case: 0603; Mounted: Yes; Sense: No; Socket: No; SMD: Yes; Manufacturer1 Example: NIC COMPONENT; Manufacturer1 ComponentHeight: 0.55mm; HelpURL: \\cern.ch\dfs\Applications\Altium\Datasheets\R0603_NIC_NRC.pdf; Author: CERN DEM JLC; CreateDate: 03.12.2007; LatestRevisionDate: 13.03.2008
T26 = BSS138LT1G: as T14 on sheet Sensor_Box_Smart_IO; Part Number: BSS138LT1G; Component Kind: Standard; Component Type: Standard; Device: BSS138LT1G; PackageDescription: SOT23 3-Leads, Pitch 0.95mm - Body 1.4x3mm, IPC Medium Density; Manufacturer Part Number: BSS138LT1G; Pin Count: 3; Case: SOT23-3; Mounted: Yes; Socket: No; SMD: Yes; Sense: No; ComponentHeight: 1.11mm; HelpURL: \\cern.ch\dfs\Applications\Altium\Datasheets\BSS138LT1G.pdf; Author: CERN DEM JLC; CreateDate: 23.03.2009; LatestRevisionDate: 23.03.2009